# Altium schematic sheet HV_DAC_8ch_DAC_channel.SchDoc: Fastino
size 420 x 297 mm; EDA_Number: ARTIQ; Projet: Fastino; Author: G.Kasprowicz; CompanyName: WUT ISE; DrawnBy: G.Kasprowicz; Organization: WUT ISE; Address1: PW ISE; Address2: Nowowiejska 15/19 00-665 Warsaw; Address3: gkasprow@gmail.com; DocumentNumber: 2; Revision: 2; SheetNumber: 2; SheetTotal: 12; ModifiedBy: -; CheckedDate: -; Title2: DAC channel; DivGrp: WUT ISE; Designer: G.Kasprowicz; ModifiedDate: -; ProjectName: Sensor Box
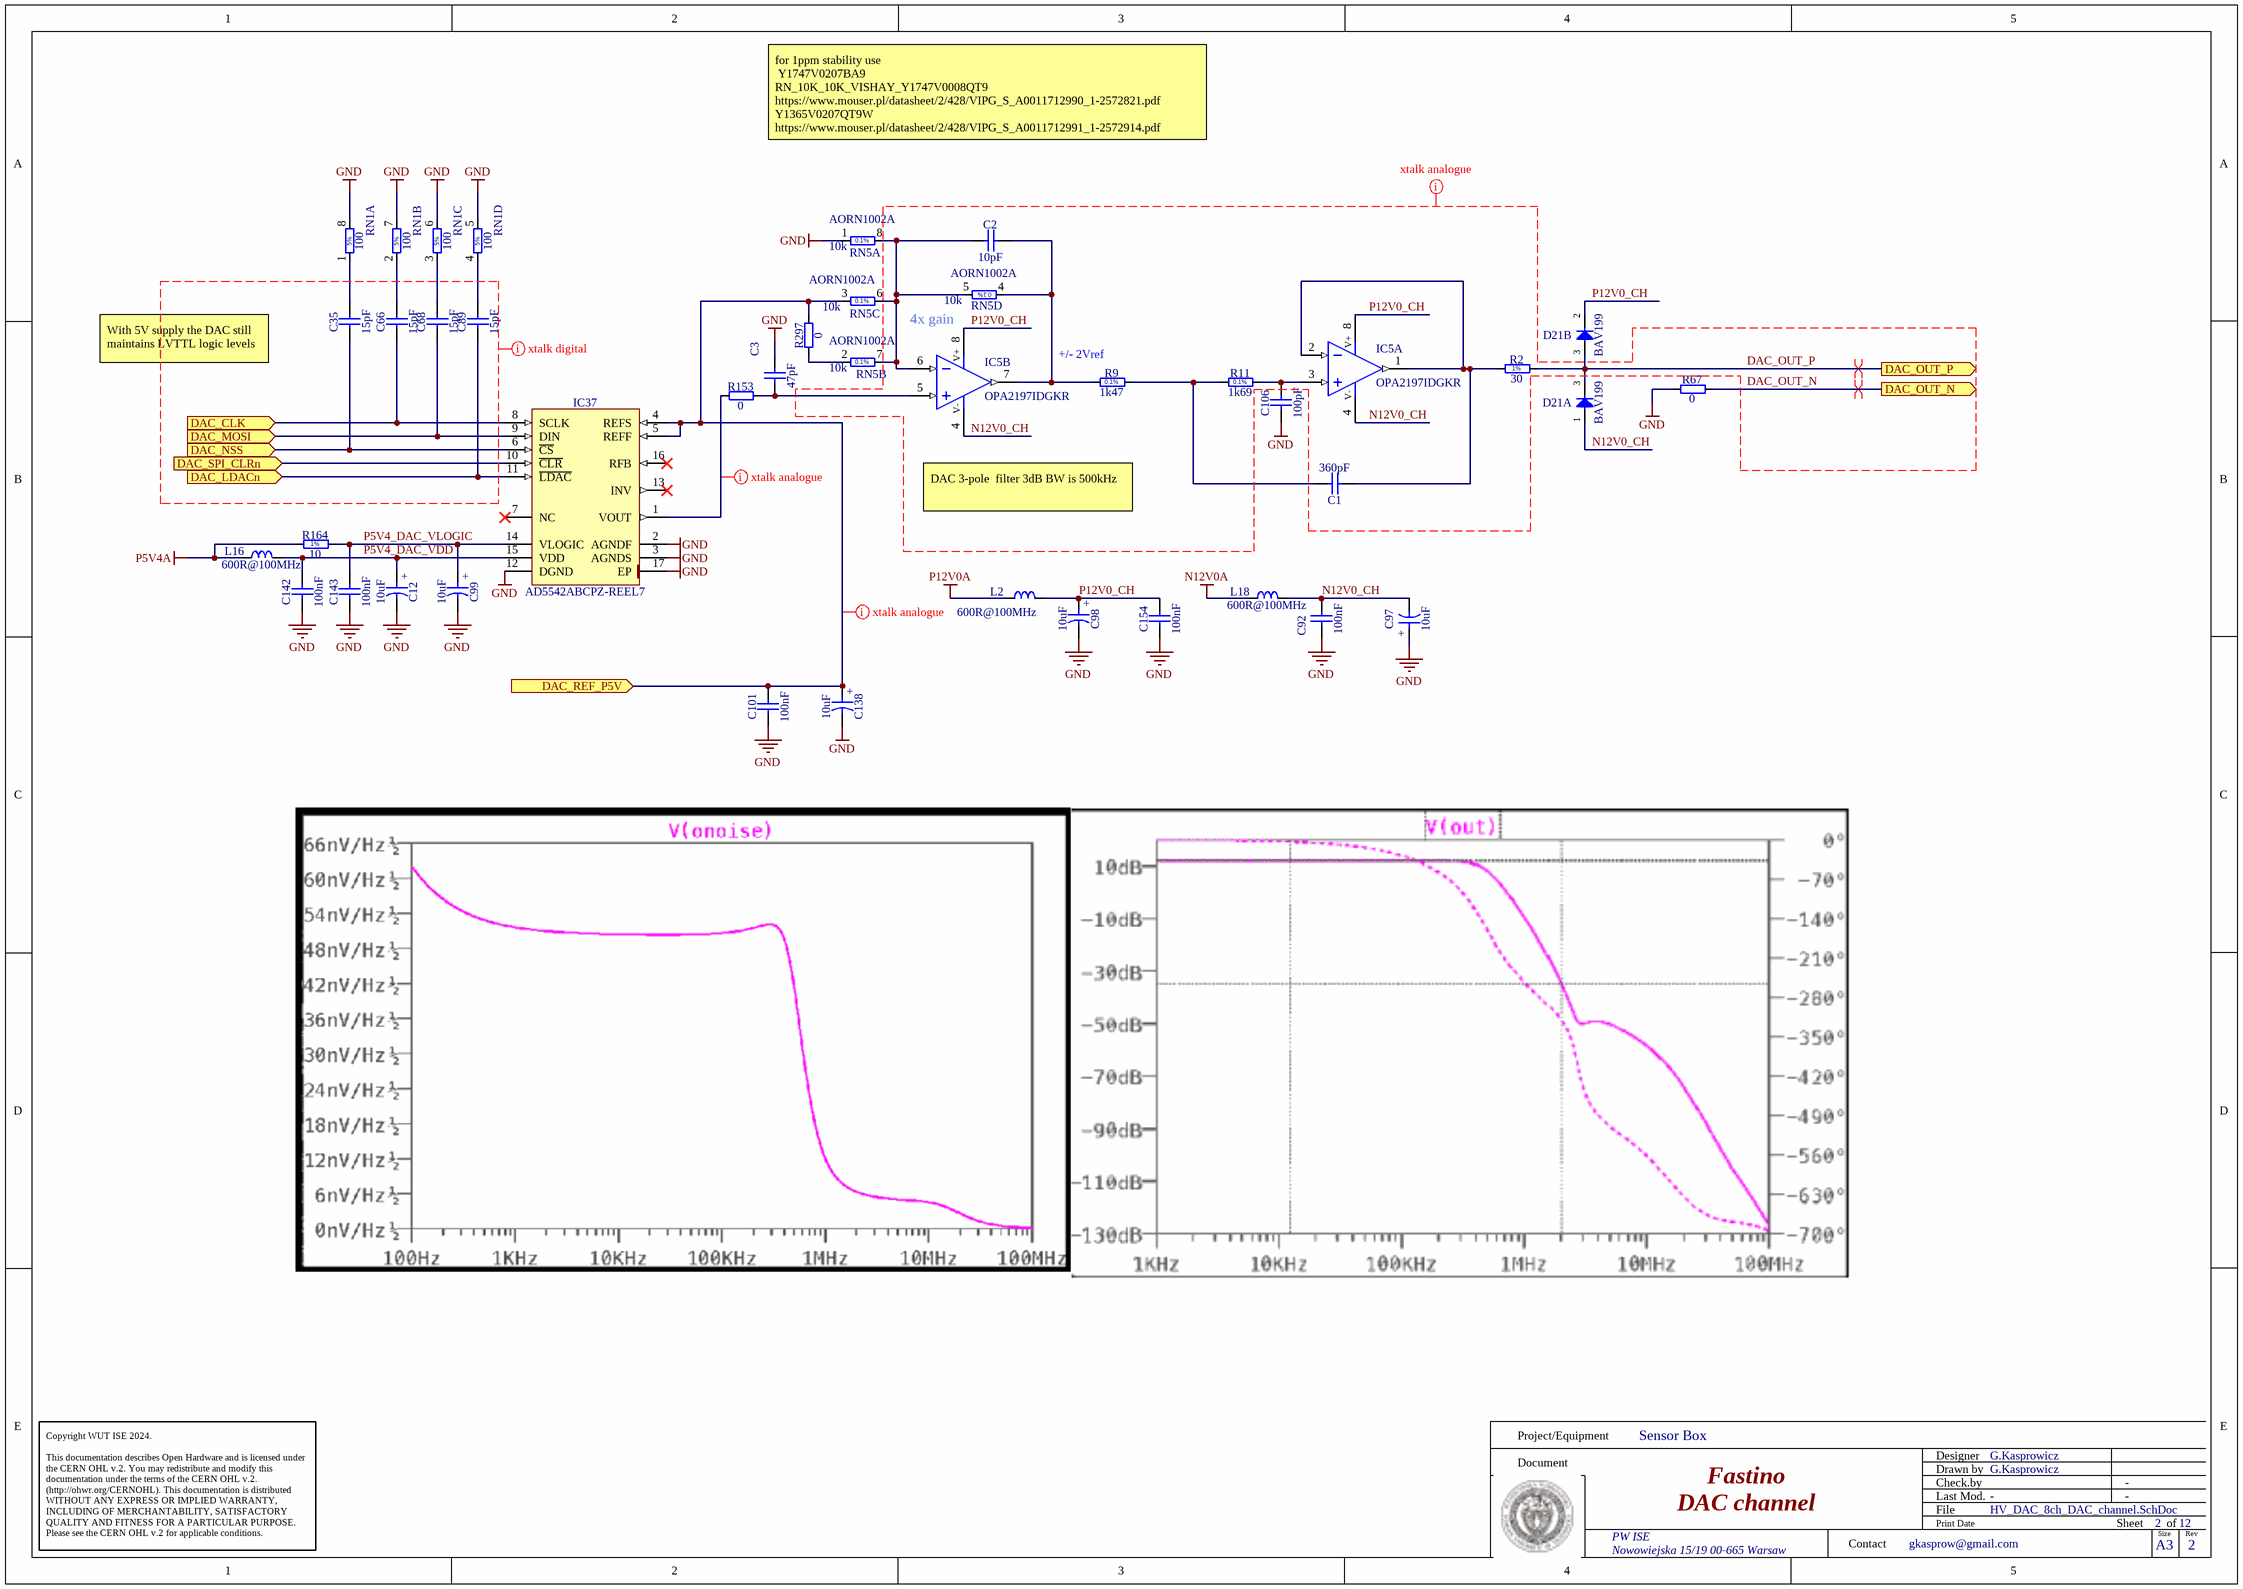
[diagram p0: HV_DAC_8ch_DAC_channel.SchDoc]

## Parts
C1  360pF  [CAPC1608X90N]
C2  10pF  [CAPC1005X55N]
C3  47pF  [CAPC1005X55N]
C12  10uF  [CAPMP3216X180N]
C35  15pF  [CAPC1608X87N]
C66  15pF  [CAPC1608X87N]
C68  15pF  [CAPC1608X87N]
C89  15pF  [CAPC1608X87N]
C92  100nF  [CAPC1005X55N]
C97  10uF  [CAPMP3216X180N]
C98  10uF  [CAPMP3216X180N]
C99  10uF  [CAPMP3216X180N]
C101  100nF  [CAPC1005X55N]
C106  100pF  [CAPC1608X90N]
C138  10uF  [CAPMP3216X180N]
C142  100nF  [CAPC1005X55N]
C143  100nF  [CAPC1005X55N]
C154  100nF  [CAPC1005X55N]
D21  BAV199  [SOT95P240X110-3N]  (parts A,B of 2)
IC5  OPA2197IDGKR  [SOP65P490X110-8N]  (parts A,B of 2)
IC37  AD5542ABCPZ-REEL7  [QFN50P300X300X80-17N-S175]
L2  600R@100MHz  [INDC1005X55N]
L16  600R@100MHz  [INDC1005X55N]
L18  600R@100MHz  [INDC1005X55N]
R2  30  [RESC1608X55N]
R9  1k47  [RESC1608X55N]
R11  1k69  [RESC1608X55N]
R67  0  [RESC1608X55N]
R153  0  [RESC1005X40N]
R164  10  [RESC1005X40N]
R297  0  [RESC0603X28N]
RN1  100  [RN_YAGEO_TC124]  (parts A,B,C,D of 4)
RN5  Manufacturer Part Number: AORN1002A  [SOIC127P600X175-8N]  (hidden comment: 10k)  (parts A,B,C,D of 4)

## Ports
DAC_CLK (in), DAC_LDACn (in), DAC_MOSI (in), DAC_NSS (in), DAC_OUT_N (out), DAC_OUT_P (out), DAC_REF_P5V (in), DAC_SPI_CLRn (in)

## Nets
GND: C3.2 C12.2 C92.1 C97.1 C98.2 C99.2 C101.1 C106.1 C138.2 C142.1 C143.1 C154.1 IC37.2(AGNDF) IC37.3(AGNDS) IC37.12(DGND) IC37.17(EP) R67.1 RN1.5 RN1.6 RN1.7 RN1.8 RN5.1
N12V0A: L18.1
P5V4A: L16.1 R164.1
P12V0A: L2.1
DAC_CLK: C66.1 IC37.8(SCLK) ; port DAC_CLK
DAC_LDACn: C89.1 IC37.11(~{LDAC}) ; port DAC_LDACn
DAC_MOSI: C68.1 IC37.9(DIN) ; port DAC_MOSI
DAC_NSS: C35.1 IC37.6(~{CS}) ; port DAC_NSS
DAC_OUT_N: R67.2 ; port DAC_OUT_N
DAC_OUT_P: D21.3(COMAC) R2.2 ; port DAC_OUT_P
DAC_REF_P5V: C101.2 C138.1 IC37.4(REFS) IC37.5(REFF) R297.2 RN5.3 ; port DAC_REF_P5V
DAC_SPI_CLRn: IC37.10(~{CLR}) ; port DAC_SPI_CLRn
N12V0_CH: C92.2 C97.2 D21.1(A) IC5.4(V-) L18.2
P5V4_DAC_VDD: C12.1 C142.2 IC37.15(VDD) L16.2
P5V4_DAC_VLOGIC: C99.1 C143.2 IC37.14(VLOGIC) R164.2
P12V0_CH: C98.1 C154.2 D21.2(C) IC5.8(V+) L2.2
NetC1_1: C1.1 IC5.1(OUT) IC5.2(IN-) R2.1
NetC1_2: C1.2 R9.2 R11.1
NetC2_1: C2.1 IC5.6(IN-) RN5.5 RN5.6 RN5.7 RN5.8
NetC2_2: C2.2 IC5.7(OUT) R9.1 RN5.4
NetC3_1: C3.1 IC5.5(IN+) R153.2
NetC35_2: C35.2 RN1.1
NetC66_2: C66.2 RN1.2
NetC68_2: C68.2 RN1.3
NetC89_2: C89.2 RN1.4
NetC106_2: C106.2 IC5.3(IN+) R11.2
NetIC37_1: IC37.1(VOUT) R153.1
NetR297_1: R297.1 RN5.2

Not connected (* = marked no-connect by the designer): IC37 7(NC)* 13(INV)* 16(RFB)*

## Layout directives
differential pair; net class D100: DAC_OUT_N, DAC_OUT_P
net class xtalk analogue: DAC_OUT_N, DAC_OUT_P, DAC_REF_P5V, N12V0_CH, NetIC37_1, P12V0_CH
net class xtalk digital: (no net found under the mark)

## Notes on the sheet
- for 1ppm stability use
  Y1747V0207BA9
  RN_10K_10K_VISHAY_Y1747V0008QT9
  https://www.mouser.pl/datasheet/2/428/VIPG_S_A0011712990_1-2572821.pdf
  Y1365V0207QT9W
  https://www.mouser.pl/datasheet/2/428/VIPG_S_A0011712991_1-2572914.pdf
- 4x gain
- With 5V supply the DAC still maintains LVTTL logic levels
- (near R9) +/- 2Vref
- DAC 3-pole  filter 3dB BW is 500kHz
- Project/Equipment
- Document
- Designer
- Drawn by
- Check.by
- Copyright WUT ISE 2024.
  This documentation describes Open Hardware and is licensed under the CERN OHL v.2. You may redistribute and modify this documentation under the terms of the CERN OHL v.2. (http://ohwr.org/CERNOHL). This documentation is distributed WITHOUT ANY EXPRESS OR IMPLIED WARRANTY, INCLUDING OF MERCHANTABILITY, SATISFACTORY QUALITY AND FITNESS FOR A PARTICULAR PURPOSE. Please see the CERN OHL v.2 for applicable conditions.
- Contact
- File
- Last Mod.
- Print Date
- Sheet
- Size
- A3
- of
- Rev
- (in symbol CTE3216-18_10UF_16V_20%_AVX_TCJ) +
- (in symbol R0402_10R_1%_0.0625W_200PPM) 1%
- (in symbol R0603_1K47_0.1%_0.063W_10PPM) 0.1%
- (in symbol R0603_1K69_0.1%_0.063W_10PPM) 0.1%
- (in symbol R0603_30R_1%_0.1W_100PPM) 1%
- (in symbol RES_RN_100R_YAGEO_TC124-JR-07100RL, part A) 5%
- (in symbol RES_RN_100R_YAGEO_TC124-JR-07100RL, part B) 5%
- (in symbol RES_RN_100R_YAGEO_TC124-JR-07100RL, part C) 5%
- (in symbol RES_RN_100R_YAGEO_TC124-JR-07100RL, part D) 5%
- (in symbol RN_10K_VISHAY_AORN1002A, part A) 0.1%
- (in symbol RN_10K_VISHAY_AORN1002A, part B) 0.1%
- (in symbol RN_10K_VISHAY_AORN1002A, part C) 0.1%
- (in symbol RN_10K_VISHAY_AORN1002A, part D) 0.1%

## Library data of the parts
C1 = CC0603_360PF_25V_1%_C0G: SMD Multilayer Chip Ceramic Capacitor; Manufacturer: GENERIC; Manufacturer1 Part Number: C0603C361F5GACTU; Voltage: 25; TC: C0G/NP0; Tolerance: ±1%; Part Number: CC0603_360PF_25V_1%_C0G; Component Kind: Standard; Component Type: Standard; Pin Count: 2; Value: 360pF; Status: None; Part Description: SMD Multilayer Chip Ceramic Capacitor; Manufacturer Part Number: CC0603_360PF_25V_1%_C0G; Case: 0603; Mounted: Yes; Socket: No; SMD: Yes; Sense: No; Manufacturer1 Example: KEMET; Manufacturer1 ComponentHeight: 0.9mm; HelpURL: \\cern.ch\dfs\Applications\Altium\Datasheets\CC0603_C0G_AVX.pdf; Author: GK; CreateDate: 15.06.2017; LatestRevisionDate: 15.06.2017
C2 = CC0402_10PF_50V_5%_C0G: Non-polarised capacitor; Part Description: SMD Multilayer Chip Ceramic Capacitor; Manufacturer: GENERIC; Manufacturer1 Part Number: C0402C100J5GACTU; Voltage: 50V; TC: C0G/NP0; Tolerance: ±5%; Part Number: CC0402_10PF_50V_5%_C0G; Component Kind: Standard; Component Type: Standard; Pin Count: 2; Value: 10pF; Status: Preferred; Manufacturer Part Number: CC0402_10PF_50V_5%_C0G; Case: 0402; Mounted: Yes; Socket: No; SMD: Yes; Sense: No; Manufacturer1 Example: KEMET; Manufacturer1 ComponentHeight: 0.55mm; HelpURL: \\cern.ch\dfs\Applications\Altium\Datasheets\CC0805_C0G_KEMET_(Commercial Grade).pdf; Author: CERN DEM JLC; CreateDate: 03.12.2007; LatestRevisionDate: 22.04.2015
C3 = CC0402_47PF_50V_1%_C0G_MURATA_GJM1555C1H470FB01D: Non-polarised capacitor; Part Description: High-Q SMD Chip Monolithic Ceramic Capacitor; Manufacturer: MURATA; Voltage: 50V; TC: C0G/NP0; Tolerance: ±1%; Part Number: CC0402_47PF_50V_1%_C0G_MURATA_GJM1555C1H470FB01D; Component Kind: Standard; Component Type: Standard; Pin Count: 2; Value: 47pF; Status: None; Manufacturer Part Number: GJM1555C1H470FB01D; Case: 0402; Mounted: Yes; Socket: No; SMD: Yes; Sense: No; ComponentHeight: 0.55mm; HelpURL: \\cern.ch\dfs\Applications\Altium\Datasheets\CC0402_MURATA_GJM1555C1H470FB01D.pdf; Author: CERN DEM BC; CreateDate: 20.11.2017; LatestRevisionDate: 20.11.2017
C12 C97-C99 C138 = CTE3216-18_10UF_16V_20%_AVX_TCJ: Polarised capacitor; Part Description: ESR 0R200 Tantalum Solid Electrolytic Chip Capacitor with Conductive Polymer Electrode; Manufacturer: AVX; Manufacturer Part Number: TCJA106M016R0200 or  or TR3A106K016C1700; Voltage: 16V; Tolerance: ±20%; Part Number: CTE3216-18_10UF_16V_20%_AVX_TCJ; Component Kind: Standard; Component Type: Standard; Pin Count: 2; Value: 10uF; Status: Preferred; Case: A; Mounted: Yes; Socket: No; SMD: Yes; Sense: No; ComponentHeight: 1.8mm; HelpURL: \\cern.ch\dfs\Applications\Altium\Datasheets\CTE_AVX_TCJ.pdf; Author: CERN DEM JLC; CreateDate: 29.03.2012; LatestRevisionDate: 29.03.2012
C35 C66 C68 C89 = CC0603_15PF_50V_5%_NP0: Non-polarised capacitor; Part Description: SMD Multilayer Chip Ceramic Capacitor; Manufacturer: GENERIC; Manufacturer1 Part Number: 223886715159; Voltage: 50V; TC: C0G/NP0; Tolerance: ±5%; Part Number: CC0603_15PF_50V_5%_NP0; Component Kind: Standard; Component Type: Standard; Pin Count: 2; Value: 15pF; Status: Preferred; Manufacturer Part Number: CC0603_15PF_50V_5%_NP0; Case: 0603; Mounted: Yes; Socket: No; SMD: Yes; Sense: No; Manufacturer1 Example: PHYCOMP; Manufacturer1 ComponentHeight: 0.87mm; HelpURL: \\cern.ch\dfs\Applications\Altium\Datasheets\CC0603_NP0_PHYCOMP.pdf; Author: CERN DEM JLC; CreateDate: 03/12/2007; LatestRevisionDate: 03/12/2007
C92 C101 C142 C143 C154 = CC0402_100NF_16V_10%_X7R: Non-polarised capacitor; Part Description: SMD Multilayer Chip Ceramic Capacitor; Manufacturer: GENERIC; Manufacturer1 Part Number: GRM155R71C104KA88D; Voltage: 16V; TC: X7R; Tolerance: ±10%; Part Number: CC0402_100NF_16V_10%_X7R; Component Kind: Standard; Component Type: Standard; Pin Count: 2; Value: 100nF; Status: Not Recommended; Manufacturer Part Number: CC0402_100NF_16V_10%_X7R; Case: 0402; Mounted: Yes; Socket: No; SMD: Yes; Sense: No; Manufacturer1 Example: MURATA; Manufacturer1 ComponentHeight: 0.55mm; HelpURL: \\cern.ch\dfs\Applications\Altium\Datasheets\CC0402_X7R_MURATA_GRM.pdf; Author: CERN DEM JLC; CreateDate: 2013-12-05; LatestRevisionDate: 2007-12-03
C106 = CC0603_100PF_50V_1%_NP0: Non-polarised capacitor; Part Description: SMD Multilayer Chip Ceramic Capacitor; Manufacturer: GENERIC; Manufacturer1 Part Number: 06035A101FAT2A; Voltage: 50V; TC: C0G/NP0; Tolerance: ±1%; Part Number: CC0603_100PF_50V_1%_NP0; Component Kind: Standard; Component Type: Standard; Pin Count: 2; Value: 100pF; Status: None; Manufacturer Part Number: CC0603_100PF_50V_1%_NP0; Case: 0603; Mounted: Yes; Socket: No; SMD: Yes; Sense: No; Manufacturer1 Example: AVX; Manufacturer1 ComponentHeight: 0.9mm; HelpURL: \\cern.ch\dfs\Applications\Altium\Datasheets\CC0603_C0G_AVX.pdf; Author: CERN DEM JLC; CreateDate: 15.06.2017; LatestRevisionDate: 15.06.2017
D21 = BAV199: Serial Diode; Part Description: Low-Leakage Double Diode; Manufacturer: NXP SEMICONDUCTORS; Voltage: 75V; Power: 250mW; PressFit: No; Bonding: No; Part Number: BAV199; Component Kind: Standard; Component Type: Standard; Device: BAV199; PackageDescription: SOT23 3-Leads, Pitch 0.95mm - Body 1.4x3mm, IPC Medium Density; Manufacturer Part Number: BAV199; Pin Count: 3; Case: SOT23-3; Mounted: Yes; Socket: No; SMD: Yes; Sense: No; ComponentHeight: 1.1mm; HelpURL: \\cern.ch\dfs\Applications\Altium\Datasheets\BAV199.pdf; Author: CERN DEM JMW; CreateDate: 2008-11-21; LatestRevisionDate: 2008-11-21
IC5 = OA_OPA2197IDGKR: 36-V, Precision, Rail-to-Rail Input Output, Low Offset Voltage Op Amp 8-VSSOP; Part Description: High-Precision, Low-Noise, Rail-to-Rail Output,10-MHz Op Amp; Manufacturer: TEXAS INSTRUMENTS; PressFit: No; Bonding: No; Part Number: OPA2197IDGKR; Component Kind: Standard; Component Type: Standard; Device: OPA2197IDGKR; PackageDescription: SOP, 0.65mm pitch; 8 pin, 3.00mm W X 3.00mm L X 1.10mm H body, IPC Medium Density; Manufacturer Part Number: OPA2197IDGKR; Pin Count: 8; Case: MSOP8; Mounted: Yes; Socket: No; SMD: Yes; Sense: No; ComponentHeight: 1.1mm; Author: GK; HelpURL: \\cern.ch\dfs\Applications\Altium\Datasheets\OPA2140AIDGK.pdf; CreateDate: 20.04.2017; LatestRevisionDate: 20.04.2017
IC37 = AD5542ABCPZ-REEL7: 2.7V to 5.5V, Serial-Input, Voltage-Output, 16-Bit DAC; Manufacturer: ANALOG DEVICES; PressFit: No; Bonding: No; Part Number: AD5542ABCPZ-REEL7; Component Kind: Standard; Component Type: Standard; Device: AD5542ABCPZ-REEL7; PackageDescription: QFN, 0.50mm Pitch, Square; 16 Pin, 3.00mm L X 3.00mm W X 0.80mm H Body (w/Thermal Tab 1.75 X 1.75mm),  IPC Medium Density; Part Description: 2.7V to 5.5V, Serial-Input, Voltage-Output, 16-Bit DAC; Manufacturer Part Number: AD5542ABCPZ-REEL7; Pin Count: 17; Case: QFN16; Mounted: Yes; Socket: No; SMD: Yes; Sense: No; ComponentHeight: 0.8mm; Author: CERN DEM JLC; HelpURL: \\cern.ch\dfs\Applications\Altium\Datasheets\AD5542ABCPZ-REEL7.pdf; CreateDate: 29.11.2018; LatestRevisionDate: 29.11.2018
L2 L16 L18 = IND0402_MURATA_BLM15HD601SN1: Inductor; Part Description: SMD EMIFIL Suppression Chip Ferrite Bead; Manufacturer: MURATA; Manufacturer Part Number: BLM15HD601SN1D; Power: 300mA; Resistance: 0.85R; Tolerance: ±25%; Part Number: IND0402_MURATA_BLM15HD601SN1; Component Kind: Standard; Component Type: Standard; Pin Count: 2; Value: 600R@100MHz; Status: None; Case: 0402; Mounted: Yes; Socket: No; SMD: Yes; Sense: No; ComponentHeight: 0.55mm; HelpURL: \\cern.ch\dfs\Applications\Altium\Datasheets\IND0402_MURATA_BLM15H.pdf; Author: CERN DEM JLC; CreateDate: 28/02/2012; LatestRevisionDate: 28/02/2012
R2 = R0603_30R_1%_0.1W_100PPM: Resistor - 1%; Part Description: General Purpose Thick Film Chip Resistor; Manufacturer: GENERIC; Manufacturer1 Part Number: NRC06F30R0TRF; Power: 0.1W; TC: ±100ppm/°C; PressFit: No; Part Number: R0603_30R_1%_0.1W_100PPM; Component Kind: Standard; Component Type: Standard; Pin Count: 2; Value: 30; Status: Preferred; Tolerance: ±1%; Manufacturer Part Number: R0603_30R_1%_0.1W_100PPM; Case: 0603; Mounted: Yes; Sense: No; Socket: No; SMD: Yes; Manufacturer1 Example: NIC COMPONENT; Manufacturer1 ComponentHeight: 0.55mm; HelpURL: \\cern.ch\dfs\Applications\Altium\Datasheets\R0603_NIC_NRC.pdf; Author: CERN DEM JLC; CreateDate: 03/12/2007; LatestRevisionDate: 13/03/2008
R9 = R0603_1K47_0.1%_0.063W_10PPM: Resistor - 0.1%; Part Description: Thin Film Chip Resistor; Manufacturer: GENERIC; Manufacturer1 Part Number: RN73C1J1K47BTDF; Power: 0.063W; TC: ±10ppm; PressFit: No; Part Number: R0603_1K47_0.1%_0.063W_10PPM; Component Kind: Standard; Component Type: Standard; Pin Count: 2; Value: 1k47; Status: Not Recommended; Tolerance: ±0.1%; Manufacturer Part Number: R0603_1K47_0.1%_0.063W_10PPM; Case: 0603; Mounted: Yes; Sense: No; Socket: No; SMD: Yes; Manufacturer1 Example: TYCO HOLSWORTHY; Manufacturer1 ComponentHeight: 0.5mm; HelpURL: \\cern.ch\dfs\Applications\Altium\Datasheets\R0603_Tyco_RN73.pdf; Author: CERN DEM JLC; CreateDate: 03.12.2007; LatestRevisionDate: 13.03.2008
R11 = R0603_1K69_0.1%_0.063W_10PPM: Resistor - 0.1%; Part Description: Thin Film Chip Resistor; Manufacturer: GENERIC; Manufacturer1 Part Number: RN73C1J1K69BTDF; Power: 0.063W; TC: ±10ppm; PressFit: No; Part Number: R0603_1K69_0.1%_0.063W_10PPM; Component Kind: Standard; Component Type: Standard; Pin Count: 2; Value: 1k69; Status: Not Recommended; Tolerance: ±0.1%; Manufacturer Part Number: R0603_1K69_0.1%_0.063W_10PPM; Case: 0603; Mounted: Yes; Sense: No; Socket: No; SMD: Yes; Manufacturer1 Example: TYCO HOLSWORTHY; Manufacturer1 ComponentHeight: 0.5mm; HelpURL: \\cern.ch\dfs\Applications\Altium\Datasheets\R0603_Tyco_RN73.pdf; Author: CERN DEM JLC; CreateDate: 03.12.2007; LatestRevisionDate: 13.03.2008
R67 = R0603_0R_JUMPER: Resistor; Part Description: 1A (0.05R Max DC Resistance) Zero Ohm Jumper; Manufacturer: GENERIC; Manufacturer1 Part Number: NRC06Z0; PressFit: No; Part Number: R0603_0R_JUMPER; Component Kind: Standard; Component Type: Standard; Pin Count: 2; Value: 0; Status: Preferred; Manufacturer Part Number: R0603_0R_JUMPER; Case: 0603; Mounted: Yes; Sense: No; Socket: No; SMD: Yes; Manufacturer1 Example: NIC COMPONENT; Manufacturer1 ComponentHeight: 0.55mm; HelpURL: \\cern.ch\dfs\Applications\Altium\Datasheets\R0603_NIC_NRC.pdf; Author: CERN DEM JLC; CreateDate: 03.12.2007; LatestRevisionDate: 13.03.2008
R153 = R0402_0R_JUMPER: Resistor; Part Description: 1A (0.05R Max DC Resistance) Zero Ohm Jumper; Manufacturer: GENERIC; Manufacturer1 Part Number: 232270591001L; PressFit: No; Part Number: R0402_0R_JUMPER; Component Kind: Standard; Component Type: Standard; Pin Count: 2; Value: 0; Status: Not Recommended; Manufacturer Part Number: R0402_0R_JUMPER; Case: 0402; Mounted: Yes; Sense: No; Socket: No; SMD: Yes; Manufacturer1 Example: YAGEO PHYCOMP; Manufacturer1 ComponentHeight: 0.4mm; HelpURL: \\cern.ch\dfs\Applications\Altium\Datasheets\R0402_Phycomp_RC0402.pdf; Author: CERN DEM JLC; CreateDate: 03.12.2007; LatestRevisionDate: 17.10.2012
R164 = R0402_10R_1%_0.0625W_200PPM: Resistor - 1%; Part Description: General Purpose Thick Film Chip Resistor; Manufacturer: GENERIC; Manufacturer1 Part Number: 232270671009L; TC: ±200ppm/°C; PressFit: No; Part Number: R0402_10R_1%_0.0625W_200PPM; Component Kind: Standard; Component Type: Standard; Pin Count: 2; Value: 10; Status: Not Recommended; Power: 0.0625W; Tolerance: ±1%; Manufacturer Part Number: R0402_10R_1%_0.0625W_200PPM; Case: 0402; Mounted: Yes; Sense: No; Socket: No; SMD: Yes; Manufacturer1 Example: YAGEO PHYCOMP; Manufacturer1 ComponentHeight: 0.4mm; HelpURL: \\cern.ch\dfs\Applications\Altium\Datasheets\R0402_Phycomp_RC0402.pdf; Author: CERN DEM JLC; CreateDate: 24.06.2009; LatestRevisionDate: 17.10.2012
R297 = R0201_0R_JUMPER: Resistor; Part Description: 1A (0.05R Max DC Resistance) Zero Ohm Jumper; Manufacturer: GENERIC; Manufacturer1 Part Number: CRCW02010000Z0ED; PressFit: No; Part Number: R0201_0R_JUMPER; Component Kind: Standard; Component Type: Standard; Pin Count: 2; Value: 0; Status: Not Recommended; Manufacturer Part Number: R0201_0R_JUMPER; Case: 0201; Mounted: Yes; Sense: No; Socket: No; SMD: Yes; Manufacturer1 Example: VISHAY; Manufacturer1 ComponentHeight: 0.27mm; HelpURL: \\cern.ch\dfs\Applications\Altium\Datasheets\R0201_VISHAY_CRCW e3.pdf; Author: CERN DEM JLC; CreateDate: 19.11.2014; LatestRevisionDate: 08.01.2015
RN1 = RES_RN_100R_YAGEO_TC124-JR-07100RL: DIL8 Resistor Network 4 Isolated Resistor 5%; Part Description: Chip Resistor Array , 4 Isolated Resistors (Side Concave Terminal), TC124 Series; Manufacturer: YAGEO; Power: 0.062W; TC: ±200ppm/°C; PressFit: No; Part Number: RN_100R_YAGEO_TC124-JR-07100RL; Component Kind: Standard; Component Type: Standard; Pin Count: 8; Value: 100; Sense: No; Status: Not recommended; Tolerance: ±5%; Manufacturer Part Number: TC124-JR-07100RL; Case: 0408; Mounted: Yes; Socket: No; SMD: Yes; ComponentHeight: 0.5mm; HelpURL: \\cern.ch\dfs\Applications\Altium\Datasheets\RN_YAGEO_TC124.pdf; Author: CERN DEM BC; CreateDate: 06.05.2019; LatestRevisionDate: 06.05.2019
RN5 = RN_10K_VISHAY_AORN1002A: DIL8 Resistor Network 4 Isolated Resistor 0.1%; Part Description: Dual-In-Line Thin Film Precision Automotive Resistors Network, (4 Isolated) - AORN Series; Manufacturer: VISHAY DALE; Power: 4x0.1W; TC: ±25ppm/°C; PressFit: No; Part Number: RN_10K_VISHAY_AORN1002A; Component Kind: Standard; Component Type: Standard; Pin Count: 8; Value: 10k; Sense: No; Tolerance: ±0.1%; Case: SOIC8; Mounted: Yes; Socket: No; SMD: Yes; ComponentHeight: 1.73mm; HelpURL: \\cern.ch\dfs\Applications\Altium\Datasheets\RN_VISHAY_AORN.pdf; Author: CERN DEM JLC; CreateDate: 20.02.2017; LatestRevisionDate: 03.05.2017